# EAGLE design Si470x-Eval (EAGLE 6.5.0)
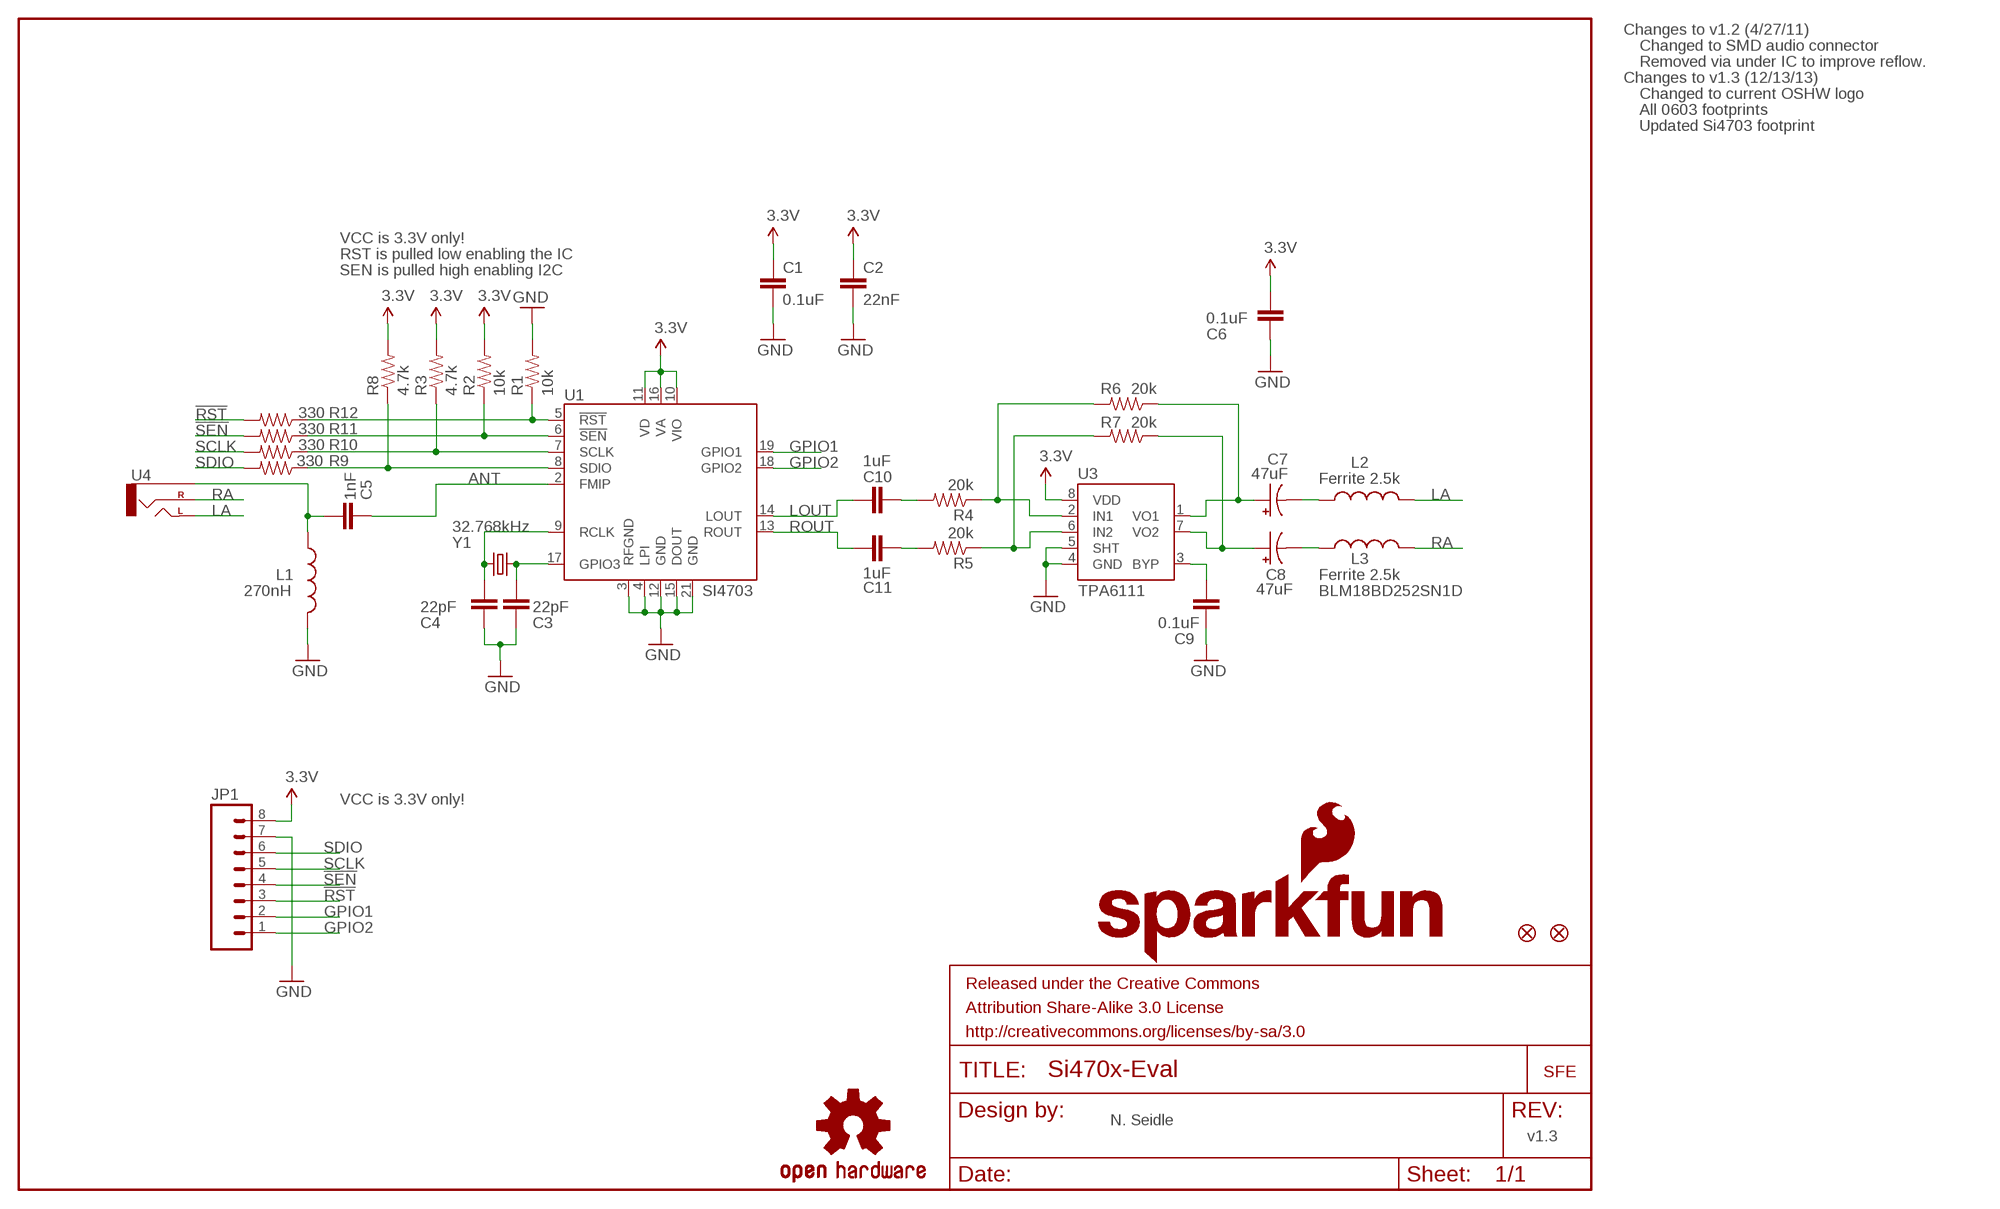
[diagram p0: schematic, sheet 1]

## Parts
C1  0.1uF  0.1UF-25V(+80/-20%)(0603)  [0603-CAP]
C2  22nF  22NF/22,000PF-50V-10%(0603)  [0603-CAP]
C3  22pF  22PF-50V-5%(0603)  [0603-CAP]
C4  22pF  22PF-50V-5%(0603)  [0603-CAP]
C5  1nF  1NF/1000PF-50V-10%(0603)  [0603-CAP]
C6  0.1uF  0.1UF-25V(+80/-20%)(0603)  [0603-CAP]
C7  47uF  47UF-TANT  [EIA3528]
C8  47uF  47UF-TANT  [EIA3528]
C9  0.1uF  0.1UF-25V(+80/-20%)(0603)  [0603-CAP]
C10  1uF  1.0UF-16V-10%(0603)  [0603-CAP]
C11  1uF  1.0UF-16V-10%(0603)  [0603-CAP]
FRAME2  FRAME-LETTER  [CREATIVE_COMMONS]
JP1  M08  [1X08]
JP3  LOGO-SFESK  [SFE-LOGO-FLAME]
JP4  FIDUCIAL1X2  [FIDUCIAL-1X2]
JP5  FIDUCIAL1X2  [FIDUCIAL-1X2]
L1  270nH  INDUCTOR0603  [0603]
L2  Ferrite 2.5k  INDUCTOR0603  [0603]
L3  Ferrite 2.5k  INDUCTOR0603  [0603]
LOGO1  SFE_LOGO_NAME_FLAME.1_INCH  [SFE_LOGO_NAME_FLAME_.1]
LOGO2  OSHW-LOGOS  [OSHW-LOGO-S]
R1  10k  10KOHM1/10W1%(0603)0603  [0603-RES]
R2  10k  10KOHM1/10W1%(0603)0603  [0603-RES]
R3  4.7k  4.7KOHM1/10W1%(0603)  [0603]
R4  20k  20KOHM1/10W1%(0603)  [0603-RES]
R5  20k  20KOHM1/10W1%(0603)  [0603-RES]
R6  20k  20KOHM1/10W1%(0603)  [0603-RES]
R7  20k  20KOHM1/10W1%(0603)  [0603-RES]
R8  4.7k  4.7KOHM1/10W1%(0603)  [0603]
R9  330  330OHM1/10W1%(0603)  [0603-RES]
R10  330  330OHM1/10W1%(0603)  [0603-RES]
R11  330  330OHM1/10W1%(0603)  [0603-RES]
R12  330  330OHM1/10W1%(0603)  [0603-RES]
U1  SI4703  SI470X  [SI470X]
U3  TPA6111  TPA6111SMD-T  [SO08-TIGHT]
U4  AUDIO-JACKSMD2  [AUDIO-JACK-3.5MM-SMD]
Y1  32.768kHz  CRYSTAL32-SMD  [CRYSTAL-32KHZ-SMD]

## Nets
3.3V: C1.1 C2.1 C6.2 JP1.8 R2.2 R3.2 R8.2 U1.10(VIO) U1.11(VD) U1.16(VA) U3.8(VDD)
!RST: JP1.3 R12.2
!RST-L: R1.1 R12.1 U1.5(!RST)
!SEN: JP1.4 R11.2
!SEN-L: R2.1 R11.1 U1.6(!SEN)
ANT: C5.1 U1.2(FMIP)
GND: C1.2 C2.2 C3.1 C4.1 C6.1 C9.2 JP1.7 L1.2 R1.2 U1.3(RFGND) U1.4(LPI) U1.12(GND) U1.15(DOUT) U1.21(GND) U3.4(GND) U3.5(SHT)
GPIO1: JP1.2 U1.19(GPIO1)
GPIO2: JP1.1 U1.18(GPIO2)
LA: L2.2 U4.TIP(LEFT)
LOUT: C10.1 U1.14(LOUT)
N$1: C4.2 U1.9(RCLK) Y1.X2
N$2: C3.2 U1.17(GPIO3) Y1.X1
N$3: C5.2 L1.1 U4.SLEEVE
N$4: C7.C(-) L2.1
N$5: C7.A(+) R6.1 U3.1(VO1)
N$6: C8.A(+) R7.1 U3.7(VO2)
N$7: C8.C(-) L3.1
N$8: C9.1 U3.3(BYP)
N$11: R4.1 R6.2 U3.2(IN1)
N$12: R5.1 R7.2 U3.6(IN2)
N$13: C10.2 R4.2
N$14: C11.2 R5.2
RA: L3.2 U4.RING(RIGHT)
ROUT: C11.1 U1.13(ROUT)
SCLK: JP1.5 R10.2
SCLK-L: R3.1 R10.1 U1.7(SCLK)
SDIO: JP1.6 R9.2
SDIO-L: R8.1 R9.1 U1.8(SDIO)

## Notes on the sheet
- Changes to v1.2 (4/27/11)
- Changed to SMD audio connector
- Removed via under IC to improve reflow.
- Changes to v1.3 (12/13/13)
- Changed to current OSHW logo
- All 0603 footprints
- Updated Si4703 footprint
- VCC is 3.3V only!
- RST is pulled low enabling the IC
- SEN is pulled high enabling I2C
- BLM18BD252SN1D
- VCC is 3.3V only!
- N. Seidle
- v1.3

## Library data of the parts
C1 C6 C9 = SparkFun-Capacitors:0.1UF-25V(+80/-20%)(0603): CAP-00810 Ceramic Standard decoupling cap; PROD_ID: CAP-00810
C2 = SparkFun-Capacitors:22NF/22,000PF-50V-10%(0603): CAP-07885; PROD_ID: CAP-07885
C3 C4 = SparkFun-Capacitors:22PF-50V-5%(0603): CAP-07876; PROD_ID: CAP-07876
C5 = SparkFun-Capacitors:1NF/1000PF-50V-10%(0603): CAP-07886; PROD_ID: CAP-07886
C7 C8 = SparkFun-Capacitors:47UF-TANT: 47uF Tantalum SMT CAP-08310- 10V 10% (EIA-3528); PROD_ID: CAP-08310
C10 C11 = SparkFun-Capacitors:1.0UF-16V-10%(0603): CAP-00868; PROD_ID: CAP-00868; VALUE: 1.0uF
FRAME2 = SparkFun-Aesthetics:FRAME-LETTER: Schematic Frame Standard 8.5x11 US Letter frame
JP1 = SparkFun:M08: Header 8 Standard 8-pin 0.1" header. Use with straight break away headers (SKU : PRT-00116), right angle break away headers (PRT-00553), swiss pins (PRT-00743), machine pins (PRT-00117), and female headers (PRT-00115).
JP3 = SparkFun:LOGO-SFE: Spark Fun Electronics PCB Logo This is the standard Spark Fun Electronics PCB logo.
JP4 JP5 = SparkFun:FIDUCIAL: Fiducial Alignment Points Various fiducial points for machine vision alignment.
L1-L3 = SparkFun-Passives:INDUCTOR: Inductors Basic Inductor/Choke - 0603 and 1206. Footprints are not proven and vary greatly between part numbers. SRN6045- 33uH, 20% 1.4A SDR0403-560KL - 56uH, 10%, 500mA RMS/740mA peak
LOGO1 = SparkFun-Aesthetics:SFE_LOGO_NAME_FLAME: SFE Logo, name and flame This is the SparkFun full logo. The logo on the schematic will always be the same size; the package variant is the height of the flame part of the logo. Default layer for the logo on the board is tSilk.
LOGO2 = SparkFun-Aesthetics:OSHW-LOGO: Open Source Hardware Logo This logo indicates the piece of hardware it is found on incorporates a OSHW license and/or adheres to the definition of open source hardware found here: http://freedomdefined.org/OSHW
R1 R2 = SparkFun-Resistors:10KOHM1/10W1%(0603): RES-00824; PROD_ID: RES-00824; VALUE: 10K
R3 R8 = SparkFun-Resistors:4.7KOHM1/10W1%(0603): RES-07857; PROD_ID: RES-07857
R4-R7 = SparkFun-Resistors:20KOHM1/10W1%(0603): RES-09383; PROD_ID: RES-09383
R9-R12 = SparkFun-Resistors:330OHM1/10W1%(0603): RES-00818; PROD_ID: RES-00818
U1 = SparkFun-RF:SI470X: FM receiver IC. Tested with Si4703. You really only need SEN, RST, SCLK, and SDIO to get a full FM radio working. Antenna comes from headphone jack. See BOB-10344.
U3 = SparkFun-AnalogIC:TPA6111; PROD_ID: IC-10149
U4 = SparkFun-Connectors:AUDIO-JACK: 3.5mm Audio Jack Simple 3.5mm common PCB mount audio jack. SKU: PRT-08032
Y1 = SparkFun-FreqCtrl:CRYSTAL: Various standard crystals. Proven footprints. Spark Fun Electronics SKU : COM-00534; PROD_ID: XTAL-07894

## Board
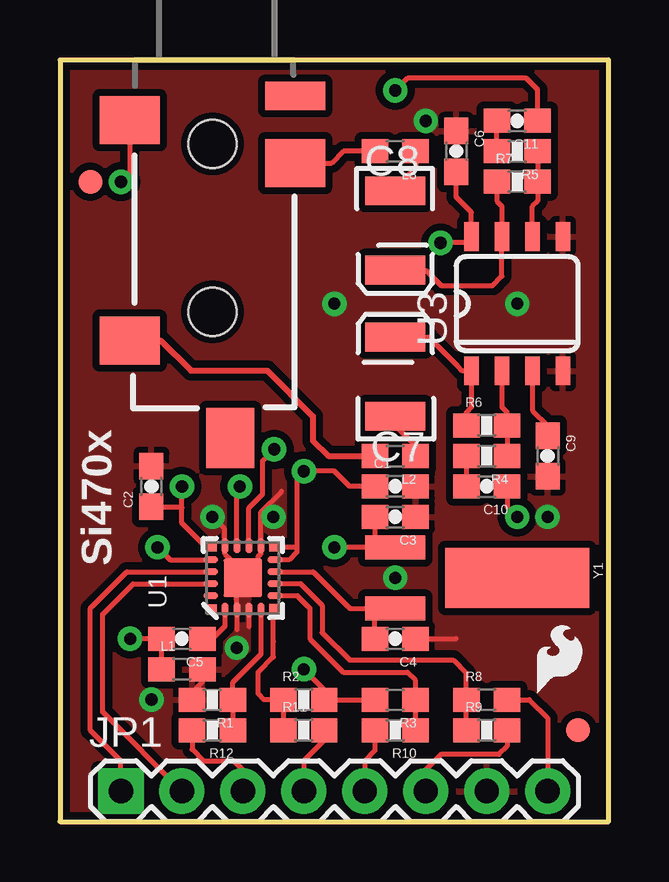
[diagram p1: board, top side]
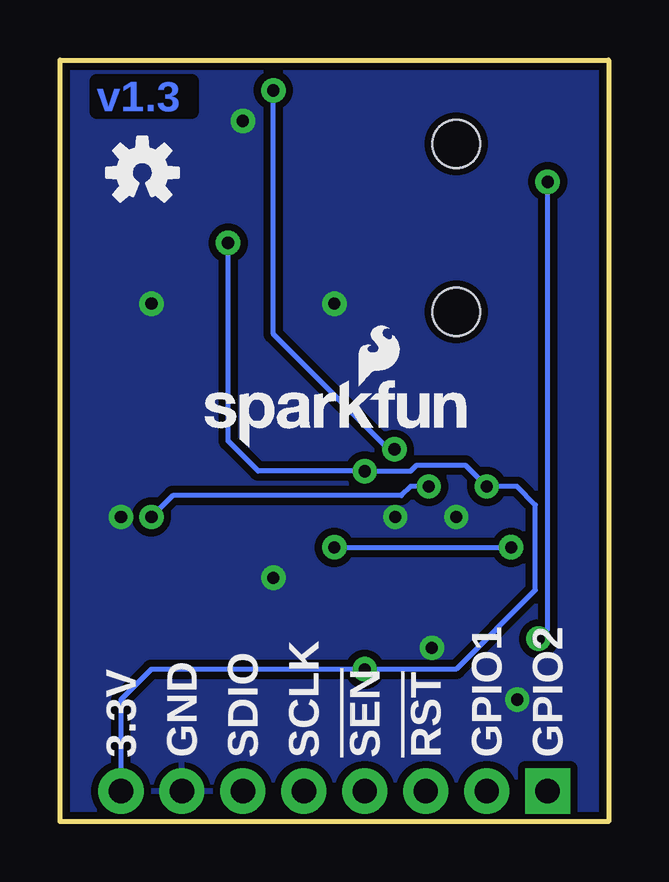
[diagram p2: board, bottom side, seen from below]

Size 22.86 x 31.75 mm. Coordinates in mm from the lower left corner, seen from the top.
Outline: 0,0 22.86,0 22.86,31.75 0,31.75 0,0
Copper layers (1*16): Top 0.035mm / dielectric 1.5mm / Bottom 0.035mm
Design rules "SparkFun *": minimum track width 8mil, minimum drill 20mil, track to track 8mil, track to pad 8mil, pad to pad 8mil, via to via 8mil, smd to smd 8mil, copper to edge 10mil, drill to drill 8mil, minimum pad ring 12mil, minimum via ring 10mil, stop-mask expansion 4mil, vias tented up to drill 20mil, thermal gap 10mil

### Footprints (pad centres in the part's own frame; a part is rotated, then mirrored left to right if it is on the bottom)
0603-CAP = smd 1.1 x 1: 1 -0.85,0; 2 0.85,0
EIA3528 = smd 1.2 x 2.5: A 1.65,0; C -1.65,0
1X08 = drill 1.016 pad 1.88 square: 1 0,0 | drill 1.016 pad 1.88: 2 2.54,0; 3 5.08,0; 4 7.62,0; 5 10.16,0; 6 12.7,0; 7 15.24,0; 8 17.78,0
FIDUCIAL-1X2 = smd 1 x 1: 1 0,0
0603 = smd 1.1 x 1: 1 -0.85,0; 2 0.85,0
0603-RES = smd 1.1 x 1: 1 -0.85,0; 2 0.85,0
SI470X = smd 0.34 x 0.34: 1 -1.275,1.265; 6 -1.265,-1.265; 11 1.265,-1.265; 16 1.265,1.265 | smd 0.61 x 0.28: 2 -1.335,0.75; 3 -1.335,0.25; 4 -1.335,-0.25; 5 -1.335,-0.75; 12 1.335,-0.75; 13 1.335,-0.25; 14 1.335,0.25; 15 1.335,0.75 | smd 0.28 x 0.61: 7 -0.75,-1.335; 8 -0.25,-1.335; 9 0.25,-1.335; 10 0.75,-1.335; 17 0.75,1.335; 18 0.25,1.335; 19 -0.25,1.335; 20 -0.75,1.335 | smd 1.6 x 1.6: 21 0,0
SO08-TIGHT = smd 0.6 x 1.2: 1 -1.905,-2.8; 2 -0.635,-2.8; 3 0.635,-2.8; 4 1.905,-2.8; 5 1.905,2.8; 6 0.635,2.8; 7 -0.635,2.8; 8 -1.905,2.8
AUDIO-JACK-3.5MM-SMD = smd 2 x 2.5: RING 4.3,3.45; SLEEVE 2.5,-3.45; TIP 11.7,-3.45 | smd 1.2 x 2.5: RSH 1.5,3.45 | smd 2.5 x 2: TSH 15.75,0.75 | hole 2: 3.5,0; 10.5,0
CRYSTAL-32KHZ-SMD = smd 2.5 x 6: SHEILD 0,5.08 | smd 1 x 2.5: X1 -1.27,0; X2 1.27,0

### Placement (x,y rotation side)
C1  13.97,13.97 0 top
C2  3.81,13.97 90 top
C3  13.97,12.7 180 top
C4  13.97,7.62 180 top
C5  5.08,7.62 180 top
C6  16.51,27.94 270 top
C7  13.97,18.54 90 top
C8  13.97,24.64 270 top
C9  20.32,15.24 270 top
C10  17.78,13.97 180 top
C11  19.05,29.21 180 top
FRAME2  17.78,-17.78 0 top  (outside the outline)
JP1  2.54,1.27 0 top
JP3  19.89,5.35 0 top
JP4  21.59,3.81 0 top
JP5  1.27,26.67 0 top
L1  5.08,6.35 0 top
L2  13.97,15.24 180 top
L3  13.97,27.94 180 top
LOGO1  17.27,15.49 0 bottom
LOGO2  19.43,27.05 0 bottom
R1  6.35,5.08 180 top
R2  10.16,5.08 0 top
R3  13.97,5.08 180 top
R4  17.78,15.24 180 top
R5  19.05,27.94 180 top
R6  17.78,16.51 0 top
R7  19.05,26.67 0 top
R8  17.78,5.08 0 top
R9  17.78,3.81 0 top
R10  13.97,3.81 180 top
R11  10.16,3.81 0 top
R12  6.35,3.81 180 top
U1  7.62,10.16 90 top
U3  19.05,21.59 0 top
U4  6.35,31.75 270 top
Y1  13.97,10.16 270 top

### Tracks (layer width: path | path; a pad name or v marks a point on that pad's centre or on a via)
3.3V  (via drill 0.51)
  Top 0.203: U1.16 6.1,11.43 5.08,12.45 5.08,13.08 | R3.2 R2.2 11.01,5.5 v10.16,6.35 | U1.10 9.55,10.91 9.87,11.23 9.87,11.43 | U1.11 9.86,11.43 9.87,11.43 | 9.87,11.43 9.87,14.31 v10.16,14.61 11.43,14.61 12.06,13.97 C1.1 | R8.2 19.56,5.08 20.32,4.32 JP1.8 | v15.86,24.12 v15.87,24.13 17.07,24.13 17.07,24.31 U3.8 17.14,25.4 16.51,26.04 C6.2 | 5.08,13.08 v5.08,13.97 | C2.1 5.04,13.12 5.08,13.08
  Bottom 0.203: JP1.8 20.32,5.08 19.05,6.35 v10.16,6.35 6.35,6.35 3.05,9.65 3.05,13.21 3.81,13.97 v5.08,13.97 5.97,14.86 8,14.86 8.26,14.61 v10.16,14.61 14.61,14.61 15.86,15.86 v15.86,24.12
!RST
  Top 0.203: R12.2 5.5,3.01 5.97,2.54 7.24,2.54 7.62,2.16 JP1.3
!RST-L
  Top 0.203: U1.5 8.37,6.97 7.2,5.8 R1.1 R12.1
!SEN
  Top 0.203: R11.2 11.01,3.39 10.16,2.54 JP1.4
!SEN-L
  Top 0.203: U1.6 8.88,7.5 8.89,7.49 8.89,6.86 8.26,6.22 8.26,5.33 8.51,5.08 R2.1 R11.1
ANT
  Top 0.203: U1.2 6.87,8.14 6.35,7.62 C5.1
GND  (via drill 0.51)
  Top 0.203: 9.24,13.77 8.37,12.9 U1.12 8.37,11.16 8.26,11.05 8.26,10.79 U1.21 | C4.1 16.51,7.62 | U1.3 | U1.3 7.37,9.65 7.62,9.91 U1.21 | U1.3 7.37,8 | 7.87,8.13 U1.4 | v6.35,12.7 6.86,12.19 6.86,11.43 6.87,11.44 U1.15 6.87,11.16 7.11,10.92 | R1.2 5.5,5.37 5.93,5.8 L1.2 | U1.21 7.11,10.67
  other vias: 19.05,21.59 11.43,21.59 13.97,10.16 7.37,7.24 8.89,12.7 3.81,5.08 15.24,29.21 20.32,12.7
  pour Bottom (isolate 0.305): 0,0 0,31.75 22.86,31.75 22.86,0
  pour Top (isolate 0.305): 0,0 0,31.75 22.86,31.75 22.86,0
GPIO1
  Top 0.203: U1.19 3.05,9.91 1.78,8.64 1.78,4.57 JP1.2
GPIO2
  Top 0.203: U1.18 2.79,10.41 1.27,8.89 1.27,3.81 2.54,2.54 JP1.1
LA
  Top 0.254: U4.TIP 4.21,20.05 5.46,18.8 8.64,18.8 10.54,16.89 10.54,15.88 11.18,15.24 L2.2
LOUT  (via drill 0.51)
  Top 0.203: C10.1 18.63,13.12 v19.05,12.7 | U1.14 7.37,13.85 v7.49,13.97
  Bottom 0.203: 18.8,12.95 v19.05,12.7 18.16,13.59 8.64,13.59 8.26,13.97 v7.49,13.97
N$1
  Top 0.203: U1.9 10.54,10.41 12.06,8.89 13.21,8.89 | 13.21,8.89 Y1.X2 | C4.2 13.12,8.8 13.21,8.89
N$2  (via drill 0.51)
  Top 0.203: U1.17 4.58,10.91 v4.06,11.43 | Y1.X1 13.21,11.43 | 13.21,11.43 v11.43,11.43 | C3.2 13.12,11.52 13.21,11.43
  Bottom 0.203: v11.43,11.43 v4.06,11.43
N$3  (via drill 0.51)
  Top 0.203: L1.1 C5.2 v2.92,7.62 | U4.SLEEVE 2.9,27.03 v2.54,26.67
  Bottom 0.203: v2.54,26.67 2.54,8 v2.92,7.62
N$4
  Top 0.203: L2.1 14.82,15.66 13.97,16.51 C7.C
N$5
  Top 0.203: C7.A 15.37,20.19 16.51,19.05 16.57,18.99 16.77,18.79 U3.1 17.14,17.27 16.93,17.06 R6.1
N$6
  Top 0.203: C8.A 15.24,22.99 15.88,22.35 18.03,22.35 18.41,22.73 U3.7 18.41,25.65 18.2,25.87 R7.1
N$7
  Top 0.203: C8.C 13.97,26.42 14.82,27.27 L3.1
N$8
  Top 0.203: U3.3 19.68,17.14 20.32,16.51 C9.1
N$11
  Top 0.203: U3.2 18.41,17.27 18.63,17.06 R6.2 R4.1
N$12
  Top 0.203: U3.6 19.68,25.65 19.9,25.87 R7.2 R5.1
N$13
  Top 0.203: R4.2 C10.2
N$14
  Top 0.203: R5.2 C11.2
RA
  Top 0.203: L3.2 11.81,27.94 11.32,27.45 U4.RING
ROUT  (via drill 0.51)
  Top 0.203: v8.92,15.52 8.43,15.03 8.43,13.64 7.87,13.08 U1.13 | C11.1 19.9,30.52 19.43,30.99 14.48,30.99 v13.97,30.48
  Bottom 0.203: v13.97,30.48 13.97,20.32 9.17,15.52 v8.92,15.52
SCLK
  Top 0.203: R10.2 13.12,2.96 12.7,2.54 JP1.5
SCLK-L
  Top 0.203: U1.7 9.89,9.41 10.41,8.89 10.41,7.62 11.81,6.22 14.48,6.22 14.82,5.88 R3.1 R10.1
SDIO
  Top 0.203: R9.2 18.63,3.14 18.29,2.79 15.88,2.79 15.24,2.16 JP1.6
SDIO-L
  Top 0.203: U1.8 10.03,9.91 10.92,9.02 10.92,7.87 12.06,6.73 16.38,6.73 16.93,6.18 R8.1 R9.1

### Text on the board
Bottom: v1.3
tPlace: Si470x
bPlace: GPIO2 | GPIO1 | !RST | !SEN | SCLK | SDIO | GND | 3.3V